# EAGLE design stspin32f0_rev_0_9 (EAGLE 8.2.1)

## Sheet 1 of 3
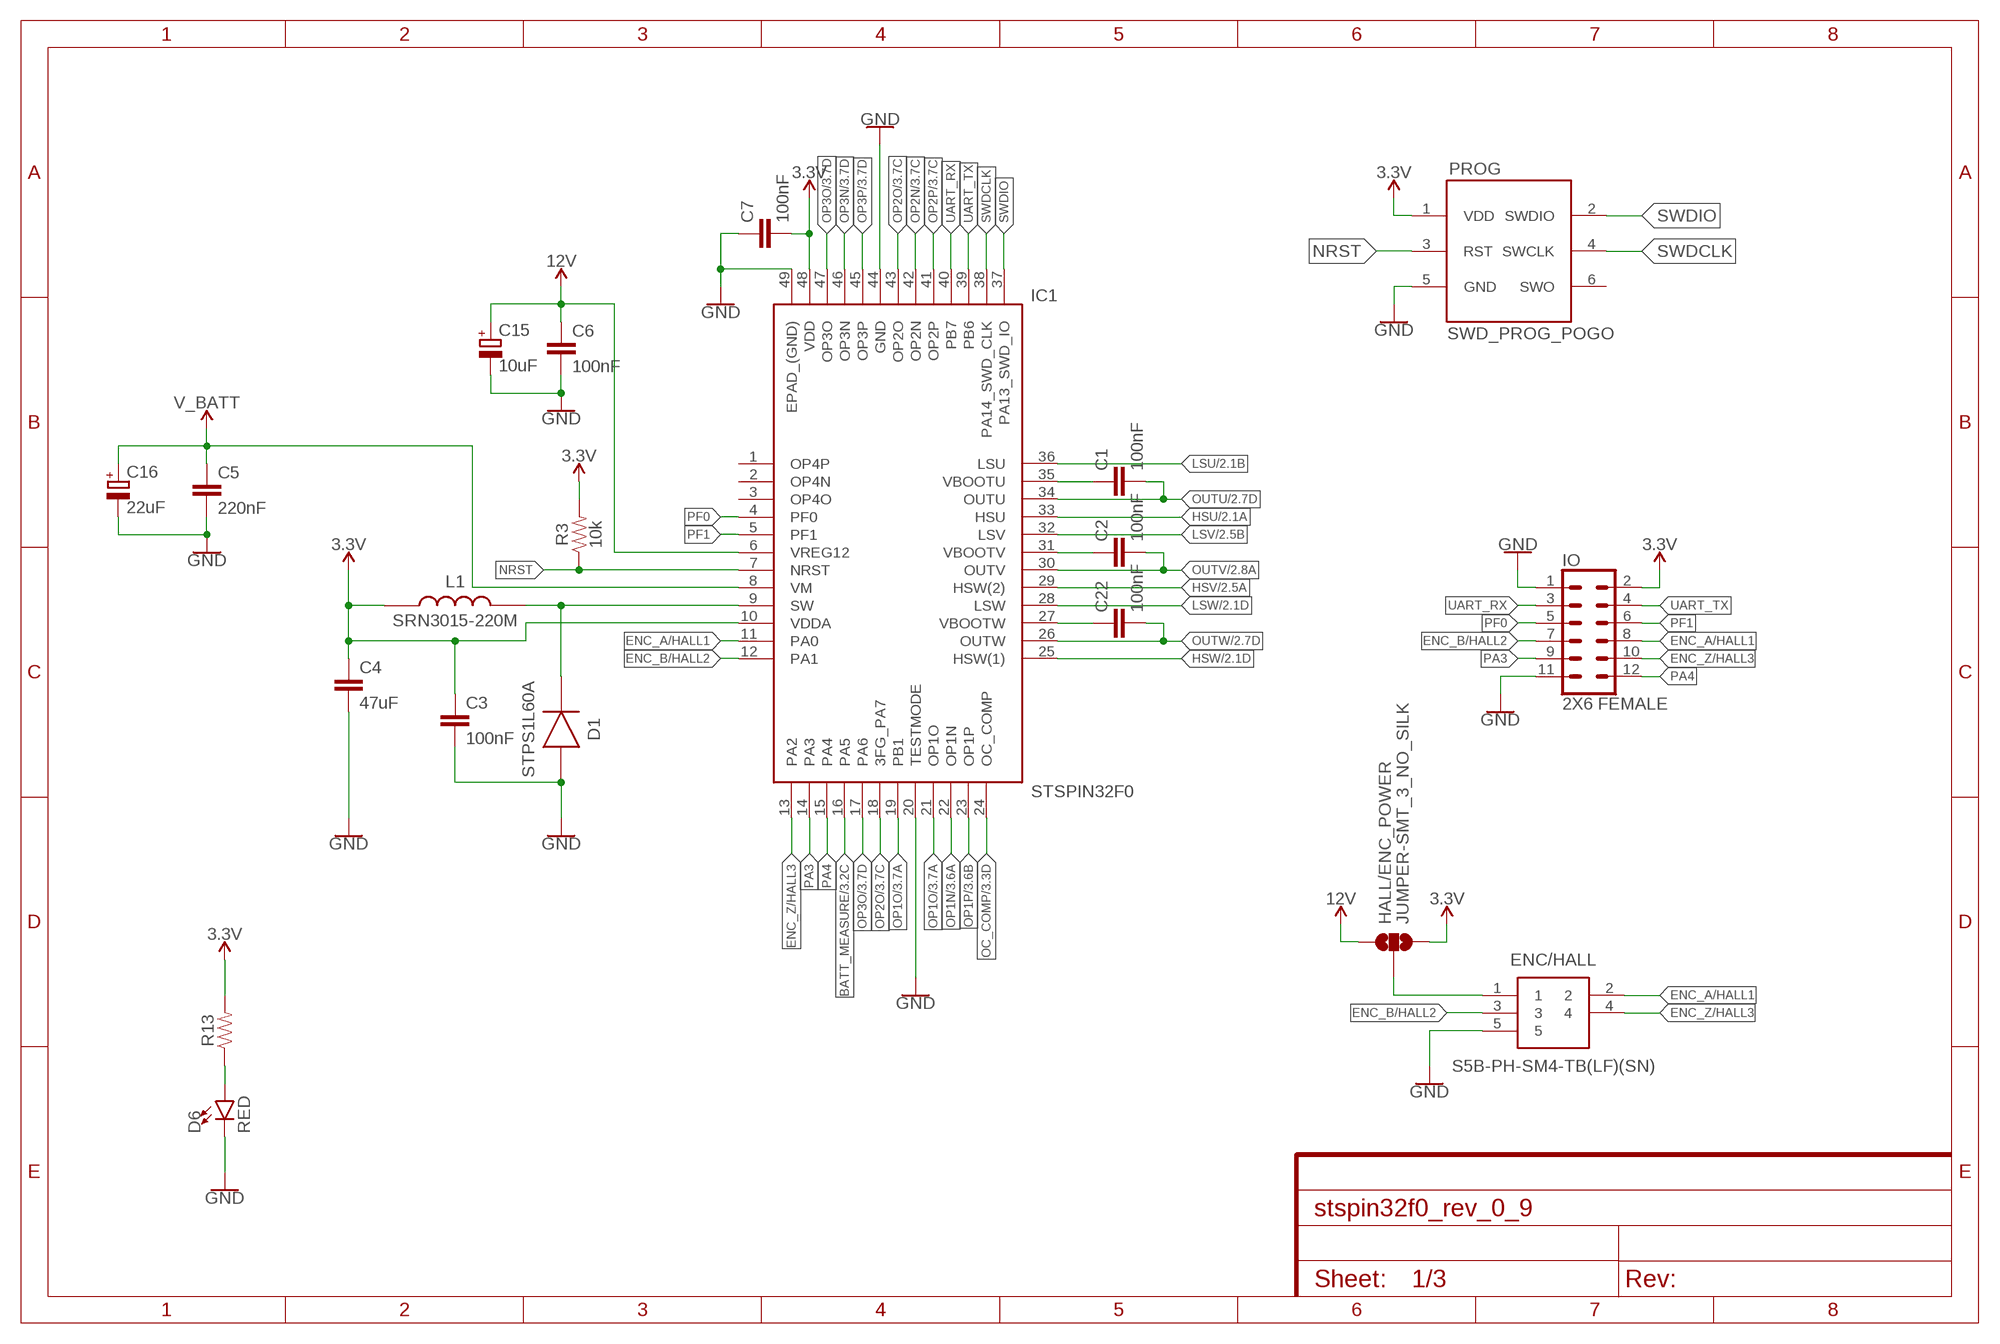
[diagram p0: schematic, sheet 1]

### Parts
C1  100nF  CAP-50V-10%-0603  [0603]
C2  100nF  CAP-50V-10%-0603  [0603]
C3  100nF  CAP-10V-20%-0603  [0603]
C4  47uF  CAP-10V-20%-0805  [0805]
C5  220nF  CAP-50V-10%-0805  [0805]
C6  100nF  CAP-25V-20%-0603  [0603]
C7  100nF  CAP-10V-20%-0603  [0603]
C15  10uF  CPOL-EUUD-5X5,8  [UD-5X5,8_NICHICON]
C16  22uF  CPOL-EUUD-6,3X8,8  [UD-6,3X5,8_NICHICON]
C22  100nF  CAP-50V-10%-0603  [0603]
D1  STPS1L60A  [DIOM5126X265N]
D6  RED  LED-RED0603  [LED-0603]
ENC/HALL  S5B-PH-SM4-TB(LF)(SN)  [S5B-PH-SM4-TB_1]
HALL/ENC_POWER  JUMPER-SMT_3_NO_SILK  [SMT-JUMPER_3_NO_SILK]
IC1  STSPIN32F0  [QFN50P700X700X100-49N]
IO  2X6 FEMALE  CONN_06X2PTH_FEMALE  [2X6]
L1  SRN3015-220M  [SRN3015]
PROG  SWD_PROG_POGO  [1X06_1.27MM]
R3  10k  RES-1/10W-5%-0603  [0603]
R13  RES-1/10W-5%-0603  [0603]

### Nets
3.3V: C3.1 C4.1 C7.2 HALL/ENC_POWER.3 IC1.10(VDDA) IC1.48(VDD) IO.2 L1.1 PROG.1(VDD) R3.2 R13.2 ; also sheet 3
12V: C6.1 C15.+ HALL/ENC_POWER.1 IC1.6(VREG12)
BATT_MEASURE: IC1.16(PA5) ; also sheet 3
ENC_A/HALL1: ENC/HALL.2 IC1.11(PA0) IO.8
ENC_B/HALL2: ENC/HALL.3 IC1.12(PA1) IO.7
ENC_Z/HALL3: ENC/HALL.4 IC1.13(PA2) IO.10
GND: C3.2 C4.2 C5.2 C6.2 C7.1 C15.- C16.- D1.2(A) D6.C ENC/HALL.5 IC1.20(TESTMODE) IC1.44(GND) IC1.49(EPAD_(GND)) IO.1 IO.11 PROG.5(GND) ; also sheet 2,3
HSU: IC1.33(HSU) ; also sheet 2
HSV: IC1.29(HSW(2)) ; also sheet 2
HSW: IC1.25(HSW(1)) ; also sheet 2
LSU: IC1.36(LSU) ; also sheet 2
LSV: IC1.32(LSV) ; also sheet 2
LSW: IC1.28(LSW) ; also sheet 2
N$2: C1.1 IC1.35(VBOOTU)
N$4: D1.1(K) IC1.9(SW) L1.2
N$5: D6.A R13.1
N$6: C2.1 IC1.31(VBOOTV)
N$16: C22.1 IC1.27(VBOOTW)
N$22: ENC/HALL.1 HALL/ENC_POWER.2
NRST: IC1.7(NRST) PROG.3(RST) R3.1
OC_COMP: IC1.24(OC_COMP) ; also sheet 3
OP1N: IC1.22(OP1N) ; also sheet 3
OP1O: IC1.19(PB1) IC1.21(OP1O) ; also sheet 3
OP1P: IC1.23(OP1P) ; also sheet 3
OP2N: IC1.42(OP2N) ; also sheet 3
OP2O: IC1.18(3FG_PA7) IC1.43(OP2O) ; also sheet 3
OP2P: IC1.41(OP2P) ; also sheet 3
OP3N: IC1.46(OP3N) ; also sheet 3
OP3O: IC1.17(PA6) IC1.47(OP3O) ; also sheet 3
OP3P: IC1.45(OP3P) ; also sheet 3
OUTU: C1.2 IC1.34(OUTU) ; also sheet 2
OUTV: C2.2 IC1.30(OUTV) ; also sheet 2
OUTW: C22.2 IC1.26(OUTW) ; also sheet 2
PA3: IC1.14(PA3) IO.9
PA4: IC1.15(PA4) IO.12
PF0: IC1.4(PF0) IO.5
PF1: IC1.5(PF1) IO.6
SWDCLK: IC1.38(PA14_SWD_CLK) PROG.4(SWCLK)
SWDIO: IC1.37(PA13_SWD_IO) PROG.2(SWDIO)
UART_RX: IC1.40(PB7) IO.3
UART_TX: IC1.39(PB6) IO.4
V_BATT: C5.1 C16.+ IC1.8(VM) ; also sheet 2,3
Unconnected: IC1.1(OP4P) IC1.2(OP4N) IC1.3(OP4O) PROG.6(SWO)

## Sheet 2 of 3
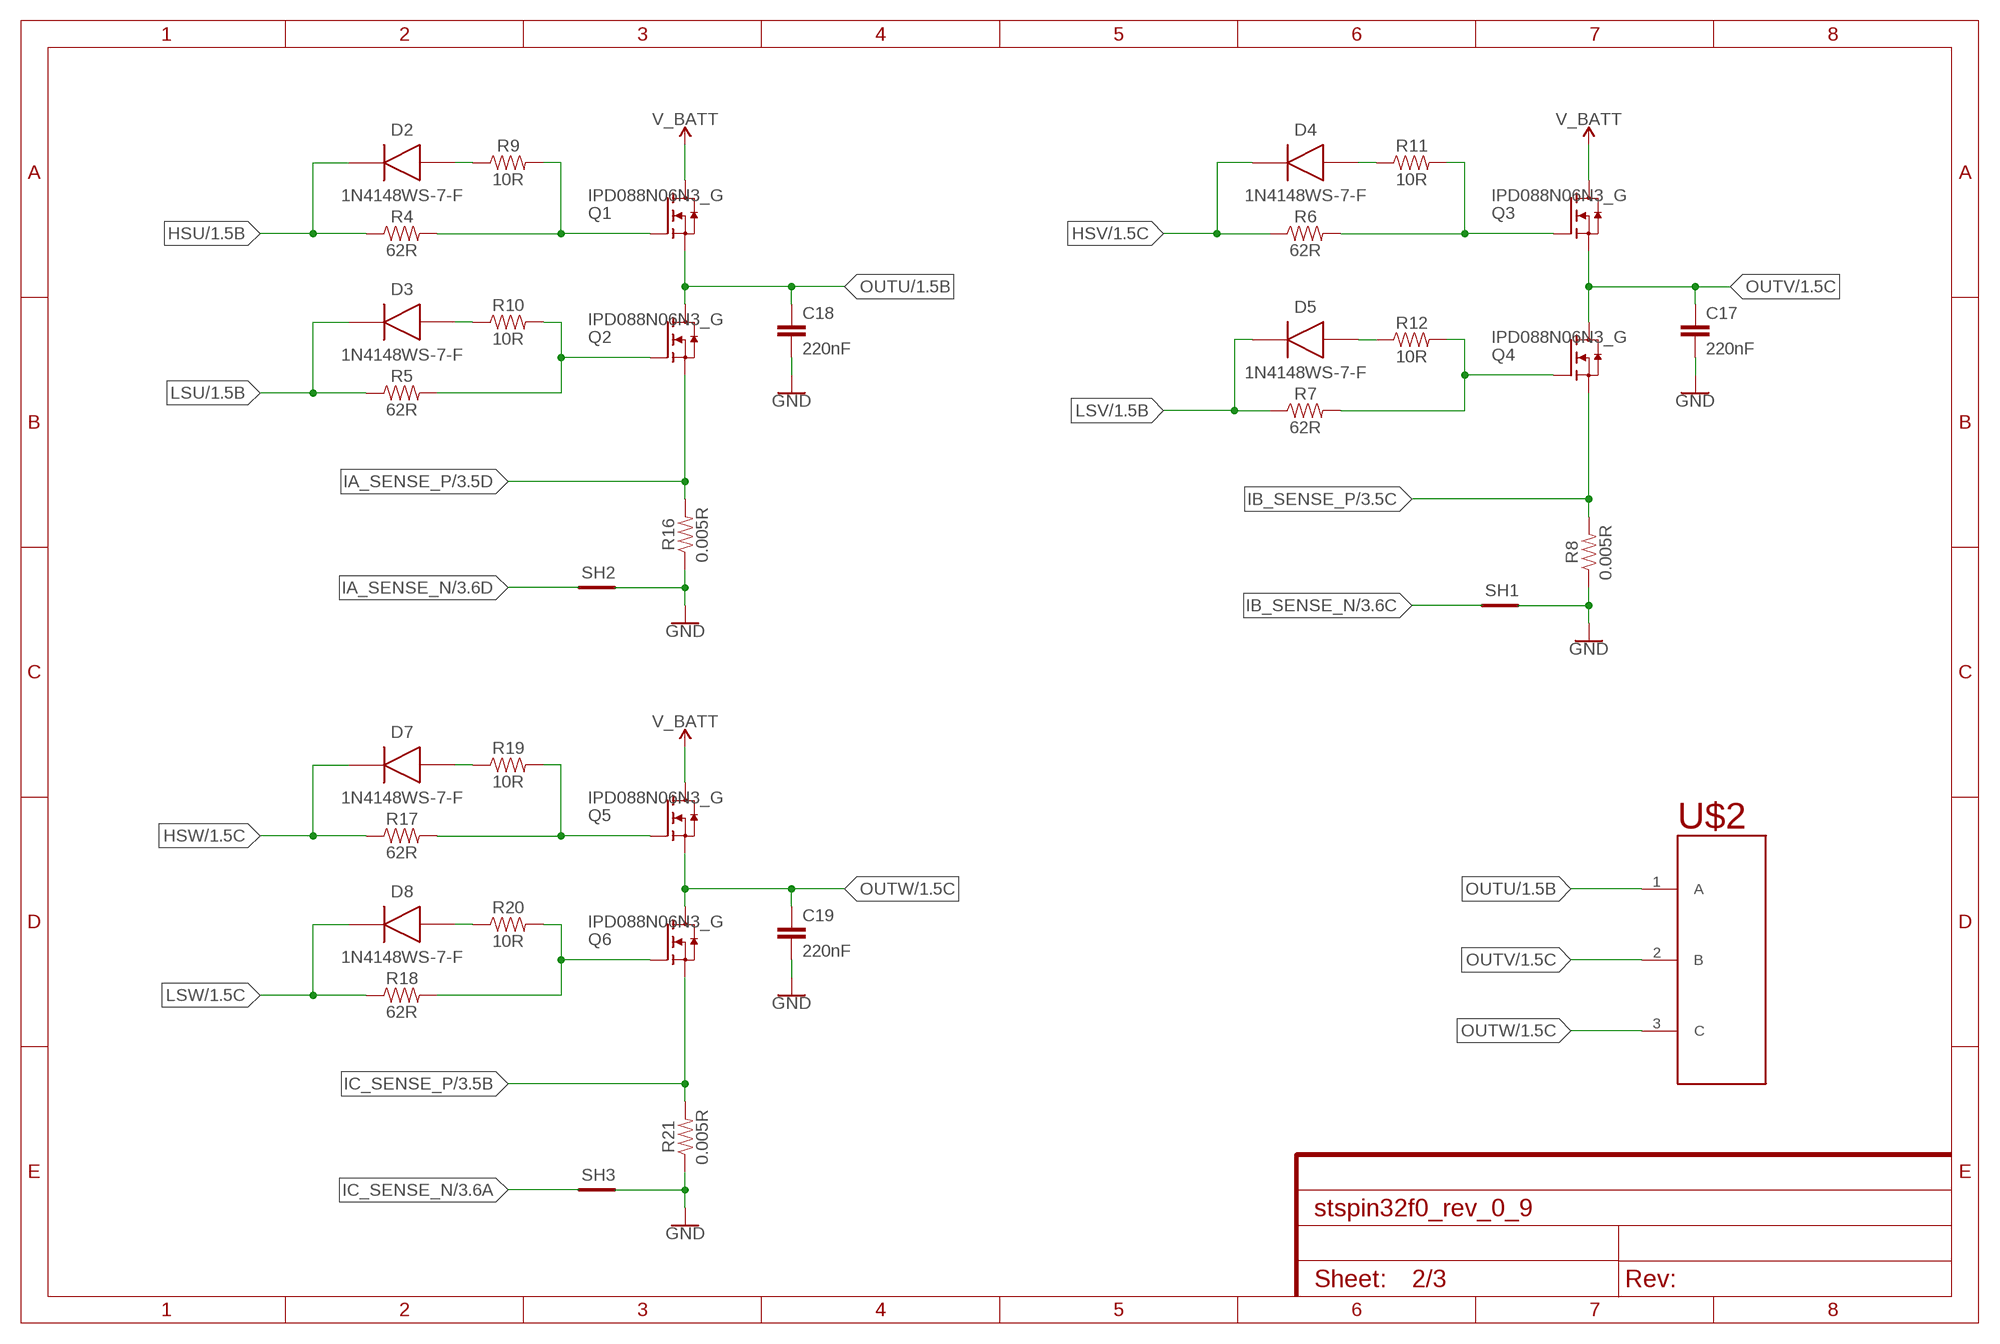
[diagram p1: schematic, sheet 2]

### Parts
C17  220nF  CAP-50V-10%-0805  [0805]
C18  220nF  CAP-50V-10%-0805  [0805]
C19  220nF  CAP-50V-10%-0805  [0805]
D2  1N4148WS-7-F  [SOD2513X120N]
D3  1N4148WS-7-F  [SOD2513X120N]
D4  1N4148WS-7-F  [SOD2513X120N]
D5  1N4148WS-7-F  [SOD2513X120N]
D7  1N4148WS-7-F  [SOD2513X120N]
D8  1N4148WS-7-F  [SOD2513X120N]
Q1  IPD088N06N3_G  [DPAK(TO-252-3)]
Q2  IPD088N06N3_G  [DPAK(TO-252-3)]
Q3  IPD088N06N3_G  [DPAK(TO-252-3)]
Q4  IPD088N06N3_G  [DPAK(TO-252-3)]
Q5  IPD088N06N3_G  [DPAK(TO-252-3)]
Q6  IPD088N06N3_G  [DPAK(TO-252-3)]
R4  62R  RES-1/10W-5%-0603  [0603]
R5  62R  RES-1/10W-5%-0603  [0603]
R6  62R  RES-1/10W-5%-0603  [0603]
R7  62R  RES-1/10W-5%-0603  [0603]
R8  0.005R  RES-3W-1%-2512  [R2512]
R9  10R  RES-1/10W-5%-0603  [0603]
R10  10R  RES-1/10W-5%-0603  [0603]
R11  10R  RES-1/10W-5%-0603  [0603]
R12  10R  RES-1/10W-5%-0603  [0603]
R16  0.005R  RES-3W-1%-2512  [R2512]
R17  62R  RES-1/10W-5%-0603  [0603]
R18  62R  RES-1/10W-5%-0603  [0603]
R19  10R  RES-1/10W-5%-0603  [0603]
R20  10R  RES-1/10W-5%-0603  [0603]
R21  0.005R  RES-3W-1%-2512  [R2512]
SH1  SHORTT5  [SHORT_TOP-50]
SH2  SHORTT5  [SHORT_TOP-50]
SH3  SHORTT5  [SHORT_TOP-50]
U$2  MR30  [MR30PW]

### Nets
GND: C17.2 C18.2 C19.2 R8.1 R16.1 R21.1 SH1.2 SH2.2 SH3.2 ; also sheet 1,3
HSU: D2.1(K) R4.1 ; also sheet 1
HSV: D4.1(K) R6.1 ; also sheet 1
HSW: D7.1(K) R17.1 ; also sheet 1
IA_SENSE_N: SH2.1 ; also sheet 3
IA_SENSE_P: Q2.3(S) R16.2 ; also sheet 3
IB_SENSE_N: SH1.1 ; also sheet 3
IB_SENSE_P: Q4.3(S) R8.2 ; also sheet 3
IC_SENSE_N: SH3.1 ; also sheet 3
IC_SENSE_P: Q6.3(S) R21.2 ; also sheet 3
LSU: D3.1(K) R5.1 ; also sheet 1
LSV: D5.1(K) R7.1 ; also sheet 1
LSW: D8.1(K) R18.1 ; also sheet 1
N$1: D7.2(A) R19.1
N$3: D8.2(A) R20.1
N$7: D4.2(A) R11.1
N$8: D2.2(A) R9.1
N$9: D3.2(A) R10.1
N$10: Q6.1(G) R18.2 R20.2
N$11: D5.2(A) R12.1
N$12: Q5.1(G) R17.2 R19.2
N$13: Q4.1(G) R7.2 R12.2
N$15: Q3.1(G) R6.2 R11.2
N$17: Q2.1(G) R5.2 R10.2
N$19: Q1.1(G) R4.2 R9.2
OUTU: C18.1 Q1.3(S) Q2.2(D) U$2.1(A) ; also sheet 1
OUTV: C17.1 Q3.3(S) Q4.2(D) U$2.2(B) ; also sheet 1
OUTW: C19.1 Q5.3(S) Q6.2(D) U$2.3(C) ; also sheet 1
V_BATT: Q1.2(D) Q3.2(D) Q5.2(D) ; also sheet 1,3

## Sheet 3 of 3
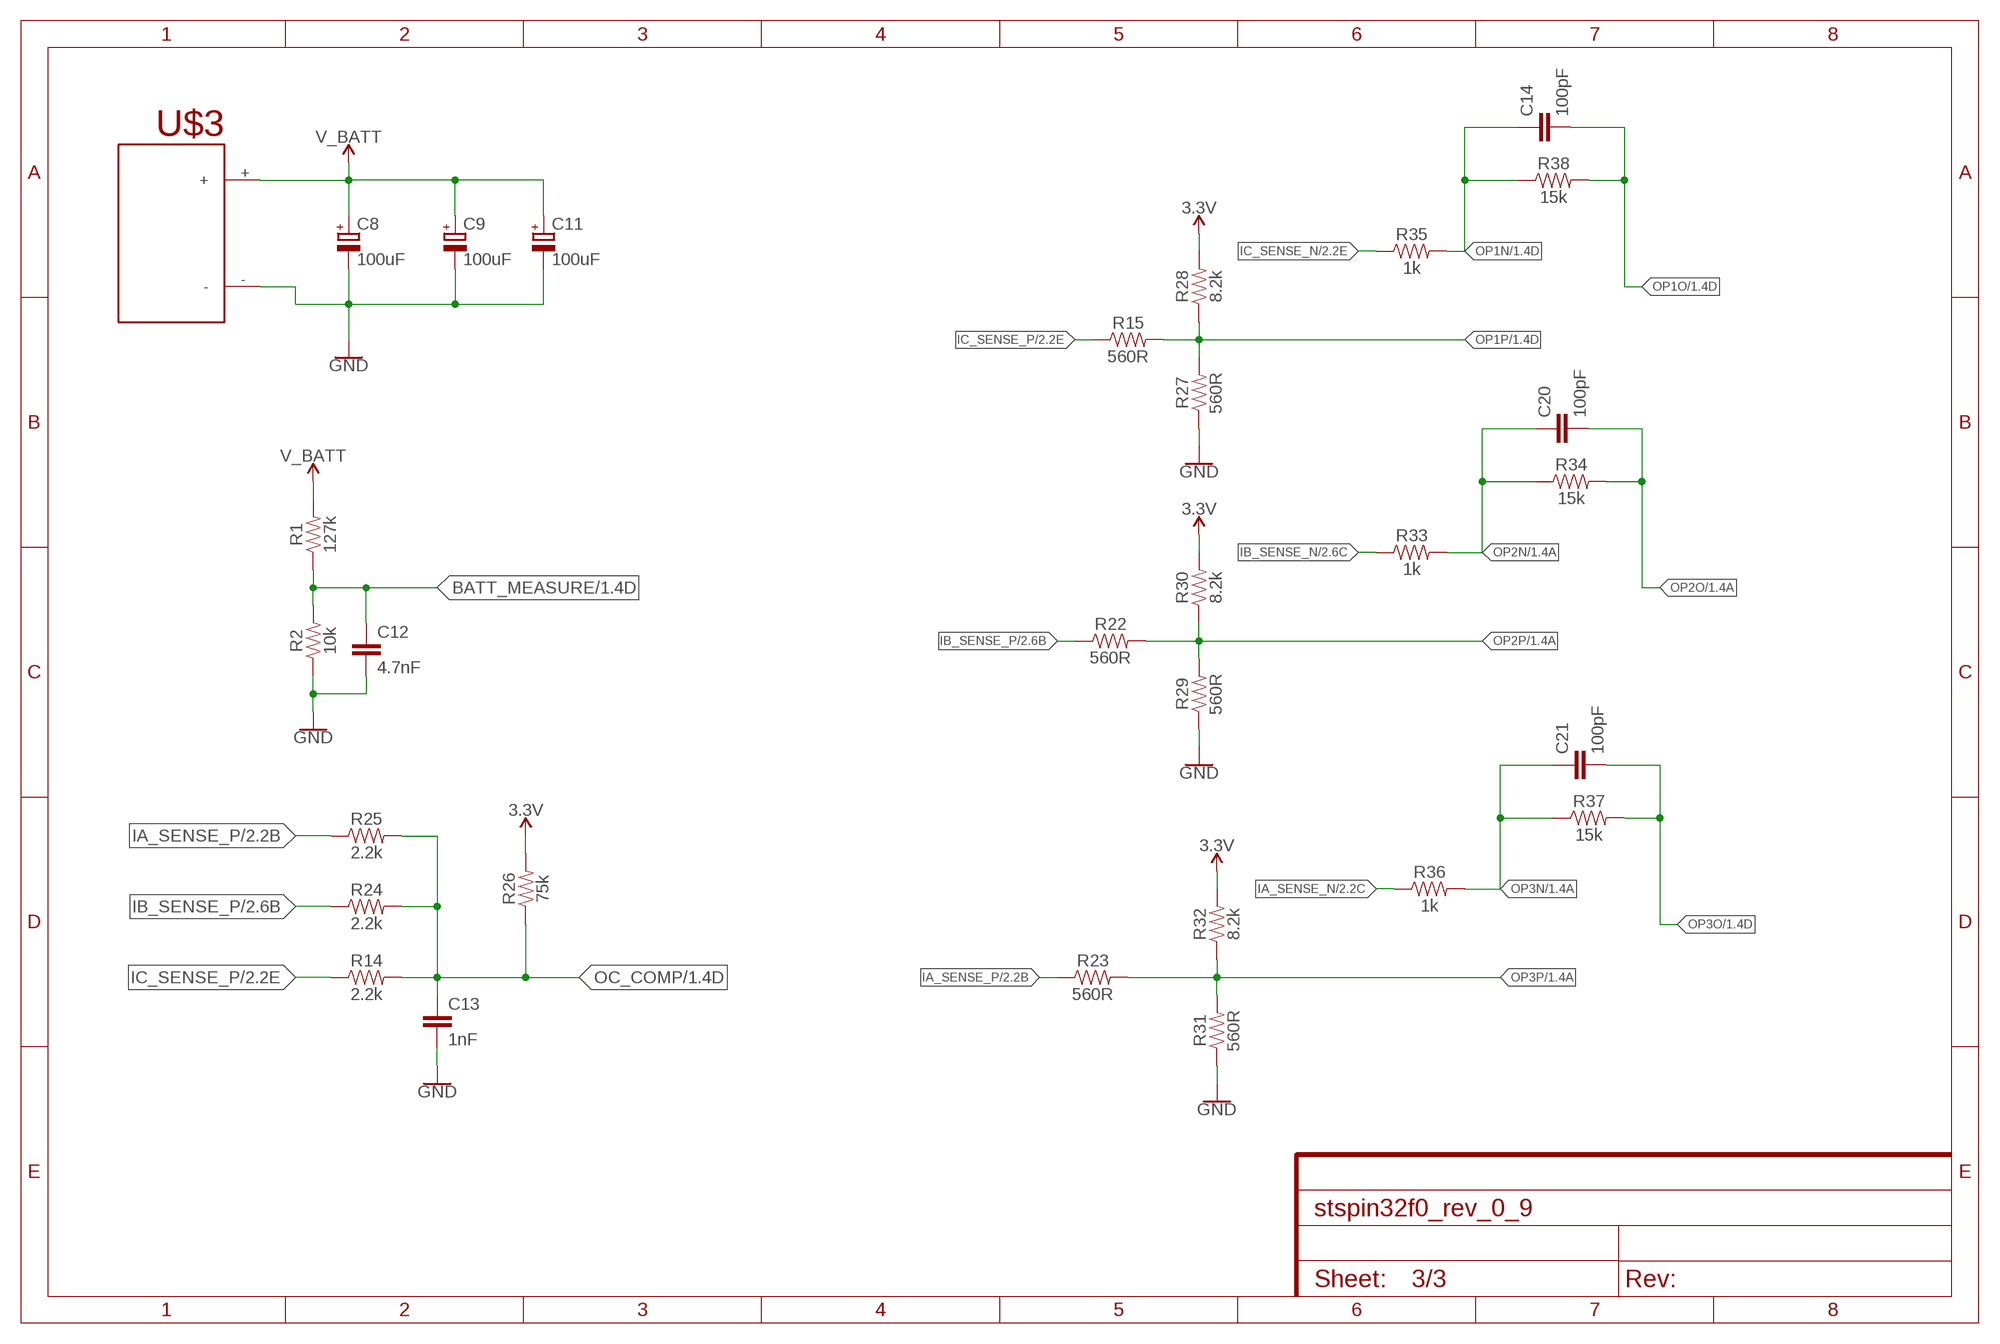
[diagram p2: schematic, sheet 3]

### Parts
C8  100uF  CPOL-EUUD-6,3X7,7  [UD-6,3X7,7_NICHICON]
C9  100uF  CPOL-EUUD-6,3X7,7  [UD-6,3X7,7_NICHICON]
C11  100uF  CPOL-EUUD-6,3X7,7  [UD-6,3X7,7_NICHICON]
C12  4.7nF  CAP-25V-20%-0603  [0603]
C13  1nF  CAP-25V-20%-0603  [0603]
C14  100pF  CAP-25V-20%-0603  [0603]
C20  100pF  CAP-25V-20%-0603  [0603]
C21  100pF  CAP-25V-20%-0603  [0603]
R1  127k  RES-1/10W-1%-0603  [0603]
R2  10k  RES-1/10W-1%-0603  [0603]
R14  2.2k  RES-1/10W-5%-0603  [0603]
R15  560R  RES-1/10W-5%-0603  [0603]
R22  560R  RES-1/10W-5%-0603  [0603]
R23  560R  RES-1/10W-5%-0603  [0603]
R24  2.2k  RES-1/10W-5%-0603  [0603]
R25  2.2k  RES-1/10W-5%-0603  [0603]
R26  75k  RES-1/10W-1%-0603  [0603]
R27  560R  RES-1/10W-5%-0603  [0603]
R28  8.2k  RES-1/10W-5%-0603  [0603]
R29  560R  RES-1/10W-5%-0603  [0603]
R30  8.2k  RES-1/10W-5%-0603  [0603]
R31  560R  RES-1/10W-5%-0603  [0603]
R32  8.2k  RES-1/10W-5%-0603  [0603]
R33  1k  RES-1/10W-5%-0603  [0603]
R34  15k  RES-1/10W-5%-0603  [0603]
R35  1k  RES-1/10W-5%-0603  [0603]
R36  1k  RES-1/10W-5%-0603  [0603]
R37  15k  RES-1/10W-5%-0603  [0603]
R38  15k  RES-1/10W-5%-0603  [0603]
U$3  XT30  [XT30PW]

### Nets
3.3V: R26.2 R28.2 R30.2 R32.2 ; also sheet 1
BATT_MEASURE: C12.1 R1.1 R2.2 ; also sheet 1
GND: C8.- C9.- C11.- C12.2 C13.2 R2.1 R27.1 R29.1 R31.1 U$3.- ; also sheet 1,2
IA_SENSE_N: R36.1 ; also sheet 2
IA_SENSE_P: R23.1 R25.1 ; also sheet 2
IB_SENSE_N: R33.1 ; also sheet 2
IB_SENSE_P: R22.1 R24.1 ; also sheet 2
IC_SENSE_N: R35.1 ; also sheet 2
IC_SENSE_P: R14.1 R15.1 ; also sheet 2
OC_COMP: C13.1 R14.2 R24.2 R25.2 R26.1 ; also sheet 1
OP1N: C14.1 R35.2 R38.1 ; also sheet 1
OP1O: C14.2 R38.2 ; also sheet 1
OP1P: R15.2 R27.2 R28.1 ; also sheet 1
OP2N: C20.1 R33.2 R34.1 ; also sheet 1
OP2O: C20.2 R34.2 ; also sheet 1
OP2P: R22.2 R29.2 R30.1 ; also sheet 1
OP3N: C21.1 R36.2 R37.1 ; also sheet 1
OP3O: C21.2 R37.2 ; also sheet 1
OP3P: R23.2 R31.2 R32.1 ; also sheet 1
V_BATT: C8.+ C9.+ C11.+ R1.2 U$3.+ ; also sheet 1,2

## Library data of the parts
C1 C2 C5 C17-C19 C22 = wiral:CAP-50V-10%: 0.1µF ceramic capacitors A capacitor is a passive two-terminal electrical component used to store electrical energy temporarily in an electric field.
C3 C4 C7 = wiral:CAP-10V-20%: 0.1µF ceramic capacitors A capacitor is a passive two-terminal electrical component used to store electrical energy temporarily in an electric field.
C6 C12-C14 C20 C21 = wiral:CAP-25V-20%: 0.1µF ceramic capacitors A capacitor is a passive two-terminal electrical component used to store electrical energy temporarily in an electric field.
C8 C9 C11 C15 C16 = rcl:CPOL-EU: POLARIZED CAPACITOR, European symbol
D1 = SamacSys_Parts:STPS1L60A: STPS1L60A, Schottky Diode, 1A max, 60V, 2-Pin, SMA <https://componentsearchengine.com/Images/3/STPS1L60A.jpg> Source: Datasheet <http://www.st.com/web/en/resource/technical/document/datasheet/CD00002285.pdf>; ALLIED_NUMBER: 70391441; DESCRIPTION: STPS1L60A, Schottky Diode, 1A max, 60V, 2-Pin, SMA; HEIGHT: 2.65mm; MANUFACTURER_NAME: STMicroelectronics; MANUFACTURER_PART_NUMBER: STPS1L60A; RS_PART_NUMBER: 250549; SUPPLIER_NAME: RS
D2-D5 D7 D8 = SamacSys_Parts:1N4148WS-7-F: Diode Switching 150mA 75V 200mW SOD323 Diodes Inc 1N4148WS-7-F Switching Diode, 150mA 75V, 2-Pin SOD-323 <https://componentsearchengine.com/Images/3/1N4148WS-7-F.jpg> Source: Datasheet <https://componentsearchengine.com/Datasheets/2/1N4148WS-7-F.pdf>; DESCRIPTION: Diode Switching 150mA 75V 200mW SOD323 Diodes Inc 1N4148WS-7-F Switching Diode, 150mA 75V, 2-Pin SOD-323; HEIGHT: 1.2mm; MANUFACTURER_NAME: Diodes Inc.; MANUFACTURER_PART_NUMBER: 1N4148WS-7-F; RS_PART_NUMBER: 9228070; SUPPLIER_NAME: RS
D6 = SparkFun-LED:LED-RED: Red SMD LED Used in manufacturing of most products at SparkFun Packages: 0603 - SMD 0603 package [Product Link] <http://docs.avagotech.com/docs/AV02-0551EN> 0603 SMART - SMD 0603 SMART package ( more efficient and expensive)[Product Link] <http://www.osram-os.com/Graphics/XPic2/00077099_0.pdf> 1206 - SMD1206 package [Product Link] <https://www.sparkfun.com/datasheets/DevTools/LilyPad/Q150OVS4.pdff> SparkFun Products: Pro Mini 328 -5V <https://www.sparkfun.com/products/821> RedBoard <https://www.sparkfun.com/products/12757> IOIO-OTG <https://www.sparkfun.com/products/13613>; PROD_ID: DIO-00819
ENC/HALL = SamacSys_Parts:S5B-PH-SM4-TB(LF)(SN): JST PH Series, 2mm Pitch 5 Way 1 Row Right Angle PCB Header, Solder Termination, 2A Source: Datasheet <http://www.jst-mfg.com/product/pdf/eng/ePH.pdf>; DESCRIPTION: JST PH Series, 2mm Pitch 5 Way 1 Row Right Angle PCB Header, Solder Termination, 2A; HEIGHT: mm; MANUFACTURER_NAME: JST (JAPAN SOLDERLESS TERMINALS); MANUFACTURER_PART_NUMBER: S5B-PH-SM4-TB(LF)(SN); SUPPLIER_NAME: RS
HALL/ENC_POWER = SparkFun-Jumpers:JUMPER-SMT_3_NO: Normally open jumper This jumper has three pads in close proximity to each other. Apply solder to close the connection(s).
IC1 = SamacSys_Parts:STSPIN32F0: Motor / Motion / Ignition Controllers & Drivers Advance BLDC Contrlr w/Embedded STM32 MCU <https://componentsearchengine.com/Images/1/STSPIN32F0.jpg> Source: Datasheet <http://www.st.com/content/ccc/resource/technical/document/datasheet/group3/4a/93/f4/8d/fb/ac/4b/18/DM00330483/files/DM00330483.pdf/jcr:content/translations/en.DM00330483.pdf>; DESCRIPTION: Motor / Motion / Ignition Controllers & Drivers Advance BLDC Contrlr w/Embedded STM32 MCU; HEIGHT: 1mm; MANUFACTURER_NAME: STMicroelectronics; MANUFACTURER_PART_NUMBER: STSPIN32F0; SUPPLIER_NAME: RS
IO = SparkFun-Connectors:CONN_06X2: Multi connection point. Often used as Generic Header-pin footprint for 0.1 inch spaced/style header connections On any of the 0.1 inch spaced packages, you can populate with these: Break Away Headers - Straight <https://www.sparkfun.com/products/116> (PRT-00116) Break Away Male Headers - Right Angle <https://www.sparkfun.com/products/553> (PRT-00553) Female Headers <https://www.sparkfun.com/products/115> (PRT-00115) Break Away Headers - Machine Pin <https://www.sparkfun.com/products/117> (PRT-00117) Break Away Female Headers - Swiss Machine Pin <https://www.sparkfun.com/products/743> (PRT-00743); PROD_ID: CONN-12423
L1 = SamacSys_Parts:SRN3015-220M: Power Inductor semi-shielded SMD 22uH Bourns SRN3015 Series Shielded Wire-wound SMD Inductor with a Ferrite Core, 22 H 20% Wire-Wound 600mA Idc <https://componentsearchengine.com/Images/1/SRN3015-220M.jpg> Source: Datasheet <http://www.farnell.com/datasheets/1875284.pdf>; DESCRIPTION: Power Inductor semi-shielded SMD 22uH Bourns SRN3015 Series Shielded Wire-wound SMD Inductor with a Ferrite Core, 22 H 20% Wire-Wound 600mA Idc; HEIGHT: mm; MANUFACTURER_NAME: Bourns; MANUFACTURER_PART_NUMBER: SRN3015-220M; RS_PART_NUMBER: 7435087; SUPPLIER_NAME: RS
PROG = wiral:SWD_PROG_POGO
Q1-Q6 = inventas:IPD088N06N3_G; MANUFACTURER_NAME: Infenion; MANUFACTURER_PART_NUMBER: IPD088N06N3 G
R1 R2 R26 = wiral:RES-1/10W-1%-: Generic Resistor Package
R3-R7 R9-R15 R17-R20 R22-R25 R27-R38 = wiral:RES-1/10W-5%-: Generic Resistor Package
R8 R16 R21 = wiral:RES-3W-1%-: Generic Resistor Package
SH1-SH3 = wiral:SHORT: Short between two nets; BOM: no
U$2 = wiral:MR30
U$3 = wiral:XT30

## Board
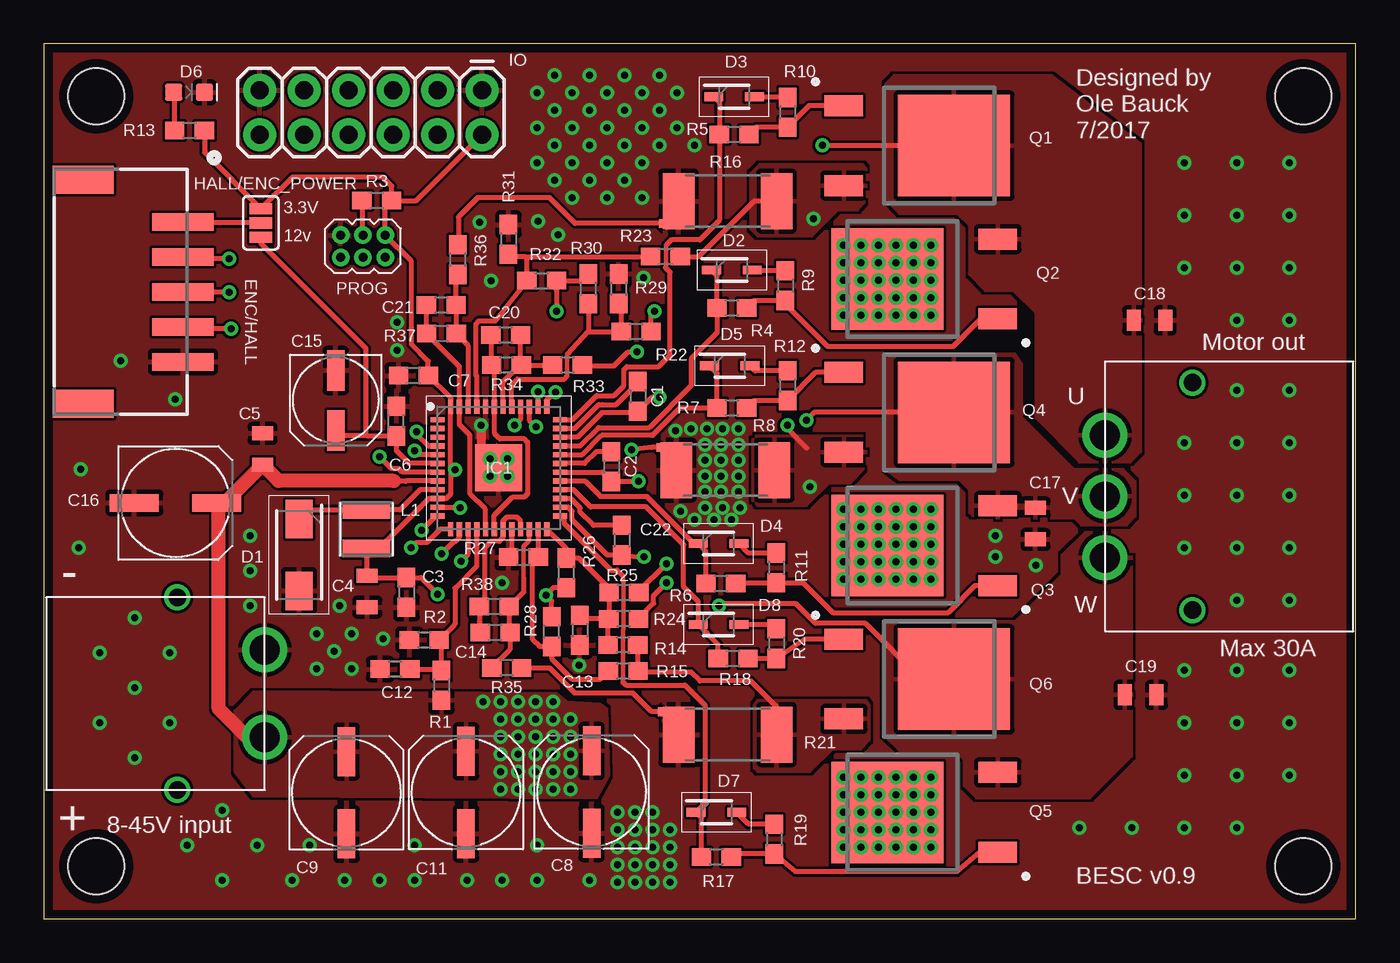
[diagram p3: board, top side]
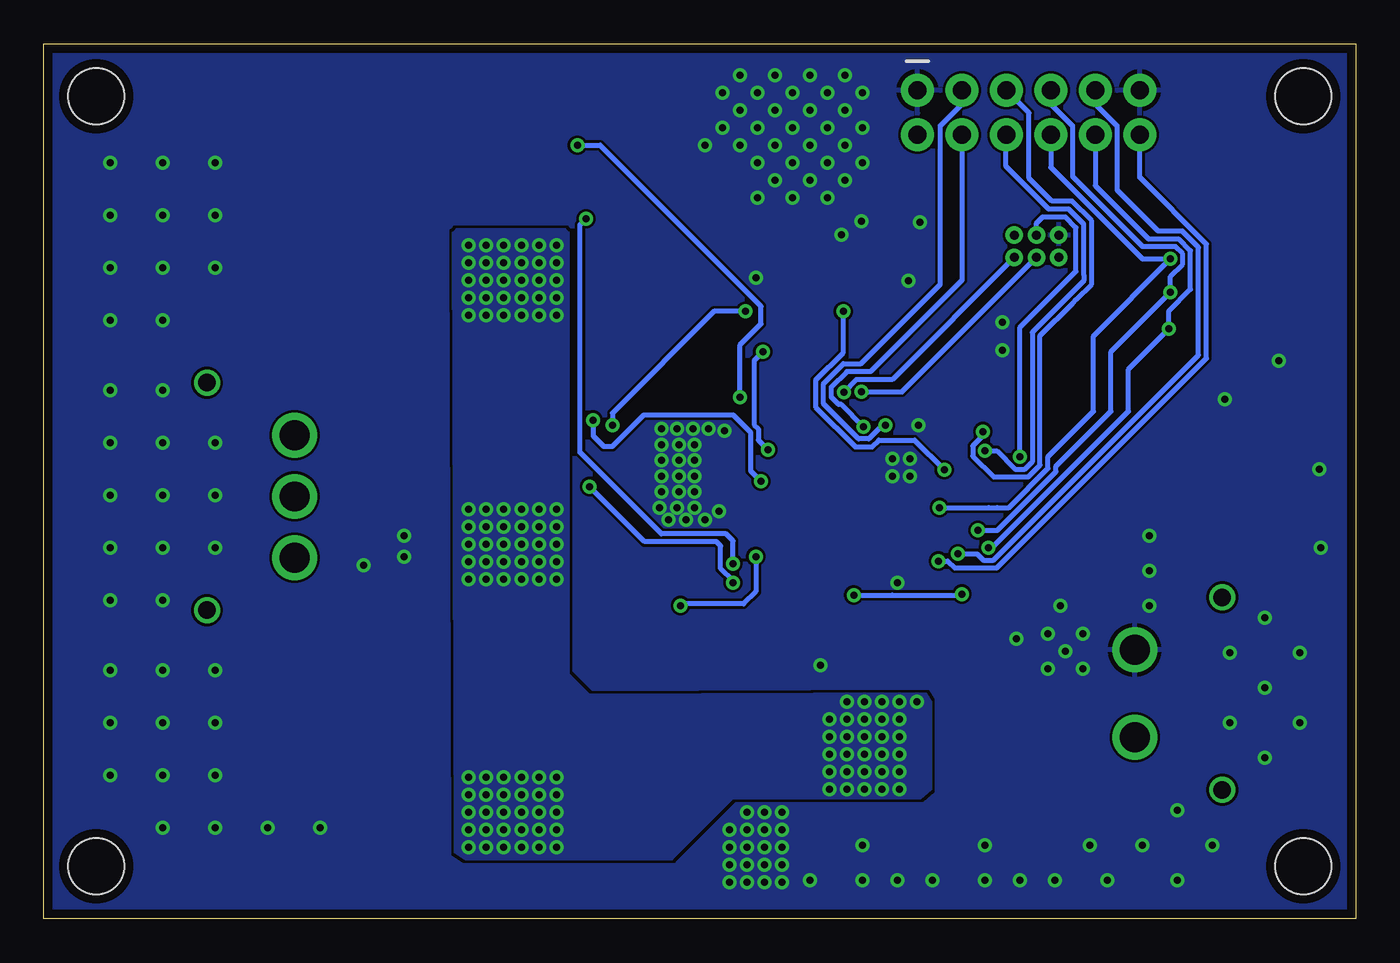
[diagram p4: board, bottom side, seen from below]

Size 75 x 50 mm. Coordinates in mm from the lower left corner, seen from the top.
Outline: 0,0 75,0 75,50 0,50 0,0
Copper layers (1*16): Top 0.035mm / dielectric 1.6mm / Bottom 0.035mm
Design rules "Elecrow_2-layer_PCB_eagle_rule": minimum track width 6mil, minimum drill 12mil, track to track 6mil, track to pad 6mil, pad to pad 6mil, via to via 8mil, smd to smd 0mil, copper to edge 20mil, drill to drill 10mil, minimum pad ring 6mil, minimum via ring 6mil, stop-mask expansion 0mil, vias tented up to drill 100mil, thermal gap 10mil
Holes 3.2 mm at 72,47 72,3 3,3 3,47

### Footprints (pad centres in the part's own frame; a part is rotated, then mirrored left to right if it is on the bottom)
0603 = smd 1.1 x 1: 1 -0.85,0; 2 0.85,0
0805 = smd 0.8 x 1.2: 1 -0.9,0; 2 0.9,0
UD-6,3X7,7_NICHICON = smd 2.8 x 1: + 2.35,0; - -2.35,0
UD-5X5,8_NICHICON = smd 2.3 x 1: + 1.725,0; - -1.7,0
UD-6,3X5,8_NICHICON = smd 2.8 x 1: + 2.35,0; - -2.35,0
DIOM5126X265N = smd 2.2 x 1.55: 1 -2.05,0; 2 2.05,0
SOD2513X120N = smd 1.075 x 0.5: 1 -1.162,0; 2 1.162,0
LED-0603 = smd 1 x 1: A -0.877,0; C 0.877,0
S5B-PH-SM4-TB_1 = smd 1 x 3.5: 1 8,0; 2 6,0; 3 4,0; 4 2,0; 5 0,0 | smd 1.6 x 3.5: 6 -2.4,5.7; 7 10.4,5.7
SMT-JUMPER_3_NO_SILK = smd 0.635 x 1.27: 1 -0.813,0; 2 0,0; 3 0.813,0
QFN50P700X700X100-49N = smd 0.8 x 0.3: 1 -3.5,2.75; 2 -3.5,2.25; 3 -3.5,1.75; 4 -3.5,1.25; 5 -3.5,0.75; 6 -3.5,0.25; 7 -3.5,-0.25; 8 -3.5,-0.75; 9 -3.5,-1.25; 10 -3.5,-1.75; 11 -3.5,-2.25; 12 -3.5,-2.75; 25 3.5,-2.75; 26 3.5,-2.25; 27 3.5,-1.75; 28 3.5,-1.25; 29 3.5,-0.75; 30 3.5,-0.25; 31 3.5,0.25; 32 3.5,0.75; 33 3.5,1.25; 34 3.5,1.75; 35 3.5,2.25; 36 3.5,2.75 | smd 0.3 x 0.8: 13 -2.75,-3.5; 14 -2.25,-3.5; 15 -1.75,-3.5; 16 -1.25,-3.5; 17 -0.75,-3.5; 18 -0.25,-3.5; 19 0.25,-3.5; 20 0.75,-3.5; 21 1.25,-3.5; 22 1.75,-3.5; 23 2.25,-3.5; 24 2.75,-3.5; 37 2.75,3.5; 38 2.25,3.5; 39 1.75,3.5; 40 1.25,3.5; 41 0.75,3.5; 42 0.25,3.5; 43 -0.25,3.5; 44 -0.75,3.5; 45 -1.25,3.5; 46 -1.75,3.5; 47 -2.25,3.5; 48 -2.75,3.5 | smd 2.7 x 2.7: 49 0,0
2X6 = drill 1.016 pad 1.88: 1 0,0; 2 0,2.54; 3 2.54,0; 4 2.54,2.54; 5 5.08,0; 6 5.08,2.54; 7 7.62,0; 8 7.62,2.54; 9 10.16,0; 10 10.16,2.54; 11 12.7,0; 12 12.7,2.54
SRN3015 = smd 2.7 x 1: 1 0,-1.1; 2 0,1.1
1X06_1.27MM = drill 0.508 pad 1: 1 0,0; 2 0,1.27; 3 1.27,0; 4 1.27,1.27; 5 2.54,0; 6 2.54,1.27
DPAK(TO-252-3) = smd 2.2 x 1.2: 1 6.3,-2.28; 3 6.3,2.28 | smd 6.4 x 5.8: 2 0,0
R2512 = smd 1.8 x 3.2: 1 -2.8,0; 2 2.8,0
SHORT_TOP-50 = smd 0.25 x 0.5: 1 0.125,0; 2 -0.125,0
MR30PW = drill 1.7: 1 -3.5,0; 2 0,0; 3 3.5,0 | drill 1: 01 -6.5,5; 02 6.5,5
XT30PW = drill 1: 01 -5.5,5; 02 5.5,5 | drill 1.7: + -2.5,0; - 2.5,0

### Placement (x,y rotation side)
C1  33.96,29.85 270 top
C2  32.44,25.84 270 top
C3  20.74,18.65 270 top
C4  18.49,18.71 270 top
C5  12.51,26.83 90 top
C6  20.16,28.44 90 top
C7  21.13,31.04 0 top
C8  31.32,7.24 90 top
C9  17.3,7.2 90 top
C11  24.14,7.22 90 top
C12  20.08,14.26 180 top
C13  30.64,16.49 270 top
C14  25.8,16.36 180 top
C15  16.69,29.63 270 top
C16  7.53,23.76 0 top
C17  56.69,22.58 270 top
C18  63.21,34.19 0 top
C19  62.7,12.79 0 top
C20  26.41,33.36 180 top
C21  22.72,35.06 180 top
C22  33.04,21.63 270 top
D1  14.59,20.79 270 top
D2  39.34,37.07 0 top
D3  39.47,46.97 0 top
D4  38.58,21.45 0 top
D5  39.21,31.61 0 top
D6  8.31,47.23 0 top
D7  38.45,6.08 0 top
D8  38.58,16.82 0 top
ENC/HALL  7.96,31.82 90 top
HALL/ENC_POWER  12.41,39.76 90 top
IC1  26,25.77 0 top
IO  25.05,47.34 180 top
L1  18.44,22.26 0 top
PROG  19.52,39.06 180 top
Q1  48.23,36.56 0 top
Q2  52.04,44.18 180 top
Q3  48.23,21.32 0 top
Q4  52.04,28.94 180 top
Q5  48.23,6.08 0 top
Q6  52.04,13.7 180 top
R1  22.74,13.34 270 top
R2  21.75,15.94 0 top
R3  19.04,41.04 0 top
R4  39.34,34.91 0 top
R5  39.47,44.81 0 top
R6  38.7,19.16 0 top
R7  39.34,29.19 0 top
R8  38.96,25.64 0 top
R9  42.39,36.18 270 top
R10  42.52,46.09 270 top
R11  41.88,20.05 270 top
R12  42.52,30.46 270 top
R13  8.34,45.05 0 top
R14  33.11,15.65 180 top
R15  33.12,14.15 180 top
R16  39.09,41.01 0 top
R17  38.45,3.54 0 top
R18  39.41,14.88 0 top
R19  41.75,4.56 270 top
R20  41.88,15.72 270 top
R21  39.09,10.53 0 top
R22  33.87,33.55 180 top
R23  35.54,37.84 180 top
R24  33.15,17.14 180 top
R25  33.16,18.64 180 top
R26  29.86,19.77 270 top
R27  27.42,20.66 0 top
R28  29.04,16.41 90 top
R29  32.86,36 270 top
R30  31.14,35.99 90 top
R31  26.56,38.82 270 top
R32  28.47,36.46 0 top
R33  29.94,31.64 180 top
R34  26.45,31.64 180 top
R35  26.46,14.34 180 top
R36  23.66,37.67 270 top
R37  22.74,33.43 180 top
R38  25.75,17.83 180 top
SH1  35.29,26.93 180 top
SH2  35.43,39.73 180 top
SH3  35.37,11.83 180 top
U$2  60.66,24.13 270 top
U$3  12.63,12.87 90 top

### Tracks (layer width: path | path; a pad name or v marks a point on that pad's centre or on a via)
3.3V  (via drill 0.4 pad 0.8)
  Top 0.3: R28.2 29.04,18.16 v28.7,18.5 29.12,18.92 R26.2 | 18.6,21 19,21 22.02,24.02 IC1.10 23.02,24.02 23.25,24.25 23.25,25.66 | 18.6,21 L1.1 | 18.6,21 18.49,20.89 C4.1 18.6,19.5 C3.1 | 23.25,25.66 IC1.48 23.25,29.77 C7.2 21.98,31.86 21.02,32.83 21.02,37.56 PROG.1 19.52,40.67 R3.2 | R13.2 9.19,43.79 HALL/ENC_POWER.3 14.22,42.38 19.38,42.38 19.89,41.87 R3.2 | 21.09,19.15 C3.1 | R3.2 21.29,41.04 IO.2 | v29.3,34.7 29.3,35.94 R32.2 30.76,36.46 R30.2 | C3.1 21.56,19.5 v22.51,18.55 | v23.52,25.66 23.25,25.66
  Bottom 0.3: v28.7,18.5 26.49,18.5 22.56,18.5 v22.51,18.55 | v29.3,34.7 29.3,32.34 30.88,30.77 30.88,29.23 28.61,26.96 27.65,26.96 27.26,27.36 25.22,27.36 v23.52,25.66
12V
  Top 0.3: IC1.6 20.89,26.02 20.16,26.74 C6.1 18.5,27.59 | 18.5,27.59 17,27.59 C15.+ | HALL/ENC_POWER.1 12.41,38.59 18.4,32.6 18.4,27.69 18.5,27.59
BATT_MEASURE
  Top 0.3: IC1.16 24.75,20.16 23.5,18.9 23.5,16.84 R2.2 22.74,15.8 R1.1 22.67,14.26 C12.1
ENC_A/HALL1  (via drill 0.4 pad 0.8)
  Top 0.3: IC1.11 23.79,23.52 v23.8,23.5 | v10.6,37.7 8.08,37.7 ENC/HALL.2
  Bottom 0.3: v23.8,23.5 21,23.5 20.5,23.5 19.83,23.5 17.59,25.73 17.59,26.41 15,29 15,33.3 v10.6,37.7 12.19,37.7 17.43,42.94 IO.8
ENC_B/HALL2  (via drill 0.4 pad 0.8)
  Top 0.3: IC1.12 22.41,23.02 v21.6,22.2 | v10.6,35.8 7.98,35.8 ENC/HALL.3
  Bottom 0.3: v21.6,22.2 21,22.2 20.8,22.2 20.49,22.2 17.14,25.55 17.14,25.86 14,29 14,32.4 v10.6,35.8 10.6,36.71 9.9,37.41 9.9,37.99 10.31,38.4 12.17,38.4 15.88,42.12 16.12,42.35 16.19,42.42 16.19,45.31 17.43,46.56 IO.7
ENC_Z/HALL3  (via drill 0.4 pad 0.8)
  Top 0.3: v21,21.2 21.3,21.5 21.89,21.5 22.66,22.27 IC1.13 | v10.7,33.7 8.08,33.7 ENC/HALL.4
  Bottom 0.3: v21,21.2 20.8,21.2 13,29 13,31.4 v10.7,33.7 10.7,34.71 9.45,35.96 9.45,38.18 10.12,38.85 11.86,38.85 14.89,41.89 IO.10
GND  (via drill 0.4 pad 0.8)
  Top 0.15: SH2.2 35.73,39.73 36.29,40.29 R16.1
  Top 0.152: SH1.2 35.41,26.38 R8.1 | SH3.2 35.98,11.83 R21.1
  Top 0.3: IC1.20 26.75,20.84 R27.1
  Top 0.5: v25,28.2 25,26.8 v25.5,26.3
  other vias: 36.1,27.9 37,28 37.9,28 38.8,28 38.7,27.1 37.8,27.1 37.8,26.2 38.7,26.2 38.7,25.3 37.8,25.3 37.8,24.4 38.7,24.4 37.8,23.5 37.2,22.8 36.4,23.3 30.6,14.5 26.5,26.3 26.5,25.3 25.5,25.3 26.2,19.2 20.2,32.5 20.2,34.1 34.2,41.2 32.2,41.2 32.2,43.2 34.2,43.2 35.2,44.2 34.2,45.2 32.2,45.2 32.2,47.2 34.2,47.2 35.2,46.2 30.2,47.2 30.2,45.2 30.2,43.2 28.2,47.2 28.2,45.2 28.2,43.2 28.27,39.85 24.91,39.79 25.56,36.45 29.39,39.09 34.28,36.63 56.7,20.2 54.4,21.9 54.4,20.7 19.4,16 16.9,17.9 16.6,15.3 65.2,43.2 68.2,43.2 71.2,43.2 71.2,40.2 68.2,40.2 65.2,40.2 65.2,37.2 68.2,37.2 71.2,37.2 71.2,34.2 68.2,34.2 71.2,30.2 71.2,27.2 71.2,24.2 71.2,21.2 71.2,18.2 71.2,14.2 71.2,11.2 71.2,8.2 68.2,8.2 65.2,8.2 68.2,11.2 68.2,14.2 65.2,14.2 65.2,11.2 65.2,5.2 68.2,5.2 62.2,5.2 59.2,5.2 68.2,18.2 68.2,21.2 68.2,24.2 68.2,27.2 68.2,30.2 65.2,27.2 65.2,24.2 65.2,21.2 7.2,15.2 3.2,15.2 3.2,11.2 7.2,11.2 8.2,4.2 12.2,4.2 21.2,4.2 28.2,4.2 28.2,2.2 4.4,31.9 7.5,29.7 2.1,25.7 2,21.2 32.8,6.1 33.8,6.1 34.8,6.1 35.8,5.1 32.8,5.1 33.8,5.1 34.8,5.1 32.8,4.1 33.8,4.1 34.8,4.1 34.8,3.1 33.8,3.1 32.8,3.1 35.8,4.1 35.8,3.1 35.8,2.1 34.8,2.1 33.8,2.1 32.8,2.1 39.7,27.1 39.7,26.2 39.7,25.3 39.7,24.4 39.7,28 38.8,23.5 38.3,22.8 39.8,23.5 39.3,22.8 35.2,48.2 31.2,46.2 33.2,46.2 33.2,44.2 31.2,44.2 29.2,44.2 29.2,46.2 29.2,48.2 31.2,48.2 33.2,48.2 33.2,42.2 31.2,42.2 30.2,41.2 29.2,42.2 36.2,45.2 36.2,47.2 37.2,44.2 15.6,16.3 15.6,14.3 17.6,14.3 17.6,16.3 11.8,17.9 11.8,19.9 11.8,21.9 26.2,2.2 21.2,2.2 24.2,2.2 31.2,2.2 19.2,2.2 17.2,2.2 15.2,4.2 14.2,2.2 10.2,2.2 10.2,6.2 5.2,9.2 5.2,13.2 5.2,17.2
  pour Bottom (rank 2): -5,53 78,53 84,47 84,1 77,-6 -5,-6 -10,-1 -10,48
  pour Top (rank 2): -12,60 83,60 94,49 94,-3 83,-14 -10,-14 -19,-5 -19,53
HSU
  Top 0.3: 38.11,34.91 R4.1 | R4.1 38.49,36.76 D2.1 | IC1.33 30.65,27.02 31.7,28.07 34.62,28.07 37,30.45 37,32 38.49,33.49 R4.1
HSV
  Top 0.3: IC1.29 30.94,25.02 31.82,24.14 34.46,24.14 37.15,21.45 D4.1 37.85,21.01 R6.1
HSW
  Top 0.25: 33.1,19.6 33.1,19.29 33.14,19.25 33.14,16.54 33.1,16.5 33.1,13.5
  Top 0.3: R17.1 37.6,5.77 D7.1 37.8,6.59 37.8,12.2 36.65,13.35 33.3,13.35 33.14,13.5 33.1,13.5 | 33.1,19.6 32.77,19.93 32.41,19.93 29.75,22.59 29.75,22.77 IC1.25
IA_SENSE_N
  Top 0.3: SH2.1 30.37,39.73 28.9,41.2 24.8,41.2 23.7,40.1 23.7,38.56 R36.1
IA_SENSE_P  (via drill 0.4 pad 0.8)
  Top 0.3: R23.1 37.44,37.84 40.6,41.01 R16.2 | R25.1 34.01,18.71 v35.6,20.3
  Bottom 0.3: v35.6,20.3 35.6,21.6 36,22 39.7,22 44.35,26.65 44.35,39.65 v44,40
  pour Top: 47,41 47,42.9 46.8,43.1 40.9,43.1 40.4,42.6 40.4,39.4 40.8,39 43.9,39 45.4,40.5 46.5,40.5
IB_SENSE_N  (via drill 0.4 pad 0.8)
  Top 0.3: SH1.1 34.73,26.93 v33.6,26.8 | R33.1 30.83,31.6 32.6,31.6 33.4,32.4 v33.9,32.4
  Bottom 0.3: v33.9,32.4 34.4,31.9 34.4,28.24 34.15,27.99 34.15,27.35 v33.6,26.8
IB_SENSE_P  (via drill 0.4 pad 0.8)
  Top 0.3: v42.5,28.2 42.5,28 43.6,26.9 | v35.6,19.2 34.86,18.46 34.86,18.02 34,17.15 R24.1 | R22.1 34.72,34.52 v34.9,34.7
  Bottom 0.3: v42.5,28.2 42.5,28.9 36.7,34.7 v34.9,34.7 | v35.6,19.2 35.6,19.31 36.3,20.01 36.3,21.3 36.55,21.55 40.65,21.55 v43.8,24.7
  pour Top: 47,25.8 47,27.4 46.8,27.6 40.7,27.6 40.5,27.4 40.5,23.9 40.8,23.6 43.6,23.6 44.9,24.9 46.1,24.9
IC_SENSE_N
  Top 0.3: R35.1 28.92,14.34 30.36,12.89 33.68,12.89 34.74,11.83 SH3.1
IC_SENSE_P
  Top 0.3: R21.2 41.89,12.11 40.4,13.6 37.5,13.6 37,14.1 34.02,14.1 R15.1 R14.1
  pour Top: 47.2,10.2 47.2,12.2 47,12.5 40.8,12.5 40.6,12.2 40.6,8.6 40.8,8.4 43.8,8.4 45.1,9.7 46.7,9.7
LSU
  Top 0.25: 35.59,38.51 35.59,38.48 35.56,38.45 35.56,37.23 35.54,37.21
  Top 0.3: D3.1 38.62,46.66 R5.1 38.62,39.92 37.5,38.8 35.87,38.8 35.59,38.51 | 35.54,37.21 35.8,36.95 35.8,32.2 35.15,31.55 33.34,31.55 33.16,31.38 33.16,30.46 32.6,29.9 31.61,29.9 31.54,29.83 | 31.54,29.83 31.54,29.82 31.4,29.7 30.22,28.52 IC1.36 | 31.54,29.83 31.55,29.83 | 31.55,29.83 | 31.55,29.83 | 31.55,29.83 | 31.55,29.83 | 31.54,29.83 31.55,29.83 | 31.55,29.83
LSV
  Top 0.3: IC1.32 30.79,26.52 31.89,27.61 34.8,27.61 36.38,29.19 R7.1 38.49,31.17 D5.1
LSW
  Top 0.3: IC1.28 30.29,24.52 31.27,23.53 34.43,23.53 36.58,21.38 36.58,18.96 37.42,18.12 D8.1 38.55,15.68 R18.1
N$1
  Top 0.3: R19.1 40.29,5.41 D7.2
N$2
  Top 0.3: IC1.35 30.36,28.02 31.59,29.24 31.73,29.37 31.73,29.38 31.92,29.37 32.71,29.37 33.61,30.27 33.61,30.35 C1.1
N$3
  Top 0.3: D8.2 41.63,16.82 R20.1
N$4
  Top 0.3: D1.1 15.11,23.36 L1.2 20.36,23.36 21.52,24.52 IC1.9
N$5
  Top 0.3: R13.1 7.49,47.17 D6.A
N$6
  Top 0.3: IC1.31 30.93,26.02 31.6,26.69 C2.1
N$7
  Top 0.3: R11.1 40.29,20.9 D4.2
N$8
  Top 0.3: R9.1 40.54,37.03 D2.2
N$9
  Top 0.3: R10.1 40.67,46.94 D3.2
N$10
  Top 0.3: Q6.1 43.49,15.98 R20.2 41.87,14.88 R18.2
N$11
  Top 0.3: R12.1 40.67,31.31 D5.2
N$12
  Top 0.3: R17.2 39.47,3.71 R19.2 42.96,2.7 52.2,2.7 53.5,3.8 Q5.1
N$13
  Top 0.3: R7.2 40.61,29.61 R12.2 44.12,31.22 Q4.1
N$15
  Top 0.3: R6.2 39.59,19.2 R11.2 43.4,19.2 45.1,17.5 51.7,17.5 53.24,19.04 Q3.1
N$16
  Top 0.3: IC1.27 30.12,24.02 30.66,23.48 30.66,23.24 31.42,22.48 C22.1
N$17
  Top 0.3: R5.2 40.74,45.23 R10.2 43.74,46.46 Q2.1
N$19
  Top 0.3: R4.2 40.61,35.33 R9.2 42.39,35.11 44.8,32.7 52,32.7 53.58,34.28 Q1.1
N$22
  Top 0.3: HALL/ENC_POWER.2 8.02,39.76 ENC/HALL.1
NRST  (via drill 0.4 pad 0.8)
  Top 0.3: IC1.7 20.49,25.52 20.29,25.72 19.88,25.72 v19.2,26.4 | R3.1 18.19,39.12 PROG.3
  Bottom 0.3: v19.2,26.4 19.2,33.8 16,37 16,39.5 16.6,40.1 17.9,40.1 18.25,39.75 PROG.3
OC_COMP
  Top 0.3: R24.2 32.3,18.24 31.9,18.64 R25.2 32.31,18.89 30.6,20.6 29.88,20.6 R26.1 29.86,21.16 IC1.24 | R14.2 32.26,17.1 R24.2 | R24.2 30.84,17.14 C13.1
OP1N
  Top 0.25: IC1.22 27.75,21.59 27.44,21.27 27.44,19.47
  Top 0.3: R35.2 26.65,15.38 C14.1 26.6,16.41 R38.1 27.44,18.67 27.44,19.47
OP1O
  Top 0.3: IC1.21 27.25,22.74 27.03,22.97 26.48,22.97 26.25,22.74 IC1.19 26.25,21.79 26.03,21.56 25.56,21.56 25.21,21.21 25.21,18.14 R38.2 24.9,17.01 C14.2
OP1P
  Top 0.3: IC1.23 28.25,20.68 R27.2 27.95,20.34 27.95,15.95 28.34,15.56 R28.1 29.04,14.86 30.2,13.7 31.82,13.7 R15.2
OP2N
  Top 0.3: R33.2 R34.1 27.26,31.68 | 27.26,31.68 C20.1 | IC1.42 26.25,30.68 27.26,31.68
OP2O
  Top 0.3: C20.2 25.6,33.32 R34.2 25.75,31.48 IC1.43 25.75,29 25.75,28.75 25.75,27.75 26,27.5 26.08,27.42 27.48,27.42 27.66,27.24 27.66,24.29 27.48,24.11 26.81,24.11 25.75,23.05 IC1.18
OP2P
  Top 0.152: 29.92,32 29.92,32.24 29.94,32.27
  Top 0.25: 29.91,30.99 29.91,31.02 29.92,31.02 29.92,32 29.92,32.2
  Top 0.3: IC1.41 26.75,30.54 27.06,30.84 29.77,30.84 29.91,30.99 | 31.12,33.55 R22.2 33.02,34.99 R29.2 | 29.94,32.27 31.12,33.55 | R30.1 31.14,33.57 31.12,33.55
OP3N
  Top 0.3: IC1.46 24.25,32.77 R37.1 23.59,35.04 C21.1 23.57,36.73 R36.2
OP3O
  Top 0.3: C21.2 21.89,35.04 R37.2 23.75,31.57 IC1.47 23.75,28.25 24.35,27.65 24.35,24.29 25.25,23.39 IC1.17
OP3P
  Top 0.3: IC1.45 24.75,31.01 24.71,31.05 24.71,33.98 24.89,34.16 25.82,34.16 R32.1 27.62,37.72 27.5,37.84 | 27.5,37.84 R23.2 | 27.5,37.84 26.69,37.84 R31.2
OUTU  (via drill 0.4 pad 0.8)
  Top 0.3: IC1.34 30.51,27.52 31.91,28.92 33.88,28.92 C1.2 34.76,29.8 v35.2,29.8 | Q2.2 44.52,44.18 v44.5,44.2
  Bottom 0.3: v44.5,44.2 43.2,44.2 34,35 34,34 35.2,32.8 v35.2,29.8
  pour Top: 48.1,41.1 48.1,47.7 48.6,48.2 57.6,48.2 62.7,44.3 62.7,26.7 62.1,26.1 59.2,26.1 56.7,28.6 56.7,34.6 55.4,35.9 53.8,35.9 52.9,36.8 52.9,39.6 52.2,40.3 48.9,40.3
OUTV  (via drill 0.4 pad 0.8)
  Top 0.3: IC1.30 31.91,25.52 C2.2 v33.99,24.99 v34,25 | Q4.2 44.04,28.94 v43.6,28.5
  Bottom 0.3: v43.6,28.5 43.6,27.6 43,27 42.5,27 40.7,28.8 35.6,28.8 34.6,27.8 34.6,25.6 v34,25
  pour Top: 48.1,31.9 48.5,32.3 55.5,32.3 55.9,31.7 55.9,28.7 58.9,25.7 61.7,25.7 62.4,25 62.4,23 61.9,22.5 59.3,22.5 58.9,22.9 53.2,22.9 52.9,23.2 52.9,24.5 52.3,25.1 48.9,25.1 48.1,25.7
OUTW  (via drill 0.4 pad 0.8)
  Top 0.3: IC1.26 29.98,23.52 30.21,23.29 30.21,22.79 32.22,20.78 C22.2 33,20.74 v34.3,20.7 | Q6.2 50.15,13.7 46.97,16.88 44.12,16.88 43,18 38.7,18 v38.6,17.9
  Bottom 0.3: v34.3,20.7 34.3,18.7 35,18 38.5,18 v38.6,17.9
  pour Top: 48,10.5 48,16.7 48.3,17 55.5,17 58.2,19.7 58.2,20.8 59.5,22.1 61.8,22.1 62.2,21.7 62.2,9.3 59.8,6.9 53.3,6.9 52.6,7.6 52.6,9.1 52.1,9.6 48.9,9.6
PA3  (via drill 0.4 pad 0.8)
  Top 0.3: v22.74,20.85 23.45,21.56 23.53,21.56 23.75,21.79 IC1.14
  Bottom 0.3: v22.74,20.85 21.64,20.85 21.29,20.5 20.71,20.5 8.99,32.21 8.99,38.37 9.93,39.31 11.31,39.31 13.65,41.65 13.65,45.31 14.89,46.56 IO.9
PA4  (via drill 0.4 pad 0.8)
  Top 0.3: IC1.15 24.25,20.84 v23.86,20.44
  Bottom 0.3: v23.86,20.44 23.32,20.44 22.93,20.05 20.52,20.05 8.54,32.03 8.54,38.55 12.35,42.36 IO.12
PF0  (via drill 0.4 pad 0.8)
  Top 0.3: IC1.4 22,27.02 21.31,27.7 v21.31,27.84
  Bottom 0.3: v21.31,27.84 21.31,27.6 21.89,27.02 21.89,26.44 20.7,25.25 18.72,25.25 18.05,25.92 18.05,33.31 16.18,35.18 15.96,35.4 15.1,36.27 15.1,39.88 16.23,41.01 17.36,41.01 18.68,42.32 18.68,46.05 IO.5
PF1  (via drill 0.4 pad 0.8)
  Top 0.3: IC1.5 21.43,26.52 v21.19,26.73
  Bottom 0.3: v21.19,26.73 20.52,26.73 19.49,25.7 18.91,25.7 18.5,26.11 18.5,33.5 15.55,36.45 15.55,36.81 15.55,37 15.55,39.69 16.41,40.55 17.55,40.55 20,43 20,44.77 IO.6
SWDCLK  (via drill 0.4 pad 0.8)
  Top 0.3: IC1.38 v28.25,30.11
  Bottom 0.3: v28.25,30.11 25.93,30.11 PROG.4
SWDIO  (via drill 0.4 pad 0.8)
  Top 0.3: v29.27,30.1 28.95,29.84 28.95,29.82 28.75,29.62 IC1.37
  Bottom 0.3: PROG.2 26.5,30.81 28.56,30.81 v29.27,30.1
UART_RX  (via drill 0.4 pad 0.8)
  Top 0.3: IC1.40 27.25,28.55 v26.9,28.2
  Bottom 0.3: v26.9,28.2 27.06,28.2 27.84,27.42 28.42,27.42 30.43,29.42 30.43,30.58 29.29,31.72 28.28,31.72 23.75,36.25 23.75,45.31 22.51,46.56 IO.3
UART_TX  (via drill 0.4 pad 0.8)
  Top 0.3: IC1.39 27.75,28.5 v28.13,28.12
  Bottom 0.3: v28.13,28.12 29.41,29.4 29.56,29.4 29.97,29.81 29.97,30.39 29.1,31.27 27.73,31.27 22.51,36.49 IO.4
V_BATT  (via drill 0.4 pad 0.8)
  Top 0.3: Q1.2 48.64,36.56 v48.7,36.5 | Q3.2 48.62,21.32 v48.7,21.4 | Q5.2 48.68,6.08 v48.7,6.1 | IC1.8 20.71,25.02 | 20,25.02 20.71,25.02 | 20.71,25.02 20.7,25
  Top 0.8: U$3.+ 11.63,10.37 10,12 10,23.64 C16.+ 10.34,23.76 C5.1 13.43,25.02 20,25.02
  other vias: 45.7,38.5 46.7,38.5 47.7,38.5 48.7,38.5 49.7,38.5 50.7,38.5 45.7,23.4 46.7,23.4 47.7,23.4 48.7,23.4 49.7,23.4 50.7,23.4 45.7,22.4 46.7,22.4 47.7,22.4 48.7,22.4 49.7,22.4 50.7,22.4 45.7,21.4 46.7,21.4 47.7,21.4 49.7,21.4 50.7,21.4 45.7,20.4 46.7,20.4 47.7,20.4 48.7,20.4 49.7,20.4 50.7,20.4 45.7,19.4 46.7,19.4 47.7,19.4 48.7,19.4 49.7,19.4 50.7,19.4 45.7,8.1 46.7,8.1 47.7,8.1 48.7,8.1 49.7,8.1 50.7,8.1 45.7,7.1 46.7,7.1 47.7,7.1 48.7,7.1 49.7,7.1 50.7,7.1 45.7,6.1 46.7,6.1 47.7,6.1 49.7,6.1 50.7,6.1 45.7,5.1 46.7,5.1 47.7,5.1 48.7,5.1 49.7,5.1 50.7,5.1 45.7,4.1 46.7,4.1 47.7,4.1 48.7,4.1 49.7,4.1 50.7,4.1 45.7,37.5 46.7,37.5 47.7,37.5 48.7,37.5 49.7,37.5 50.7,37.5 45.7,36.5 46.7,36.5 47.7,36.5 49.7,36.5 50.7,36.5 45.7,35.5 46.7,35.5 47.7,35.5 48.7,35.5 49.7,35.5 50.7,35.5 45.7,34.5 46.7,34.5 47.7,34.5 48.7,34.5 49.7,34.5 50.7,34.5 27.1,12.4 30.1,11.4 30.1,10.4 30.1,9.4 30.1,8.4 30.1,7.4 29.1,7.4 29.1,8.4 29.1,9.4 29.1,10.4 29.1,11.4 29.1,12.4 28.1,12.4 28.1,11.4 28.1,10.4 28.1,9.4 28.1,8.4 28.1,7.4 27.1,11.4 27.1,7.4 27.1,8.4 27.1,9.4 27.1,10.4 26.1,10.4 26.1,11.4 26.1,12.4 26.1,9.4 26.1,8.4 26.1,7.4 25.1,12.4
  pour Top: 10.9,11.9 12,13 29.3,12.9 29.9,12.4 31.8,12.3 32.2,12 32.3,8.2 31.6,6.9 12,7 10.9,8.4
  pour Bottom: 45,14 45,39.2 45.2,39.4 51.4,39.4 51.6,39.2 51.5,3.8 50.9,3.4 39.1,3.4 35.6,6.9 24.9,6.9 24.3,7.4 24.3,12.4 24.6,12.9 43.8,12.8

### Text on the board
tPlace: Designed by / Ole Bauck / 7/2017 | 3.3V | 12v | Motor out | U | V | - | W | Max 30A | + | 8-45V input | BESC v0.9